# EAGLE design Phototransistor1 (EAGLE 8.5.0)
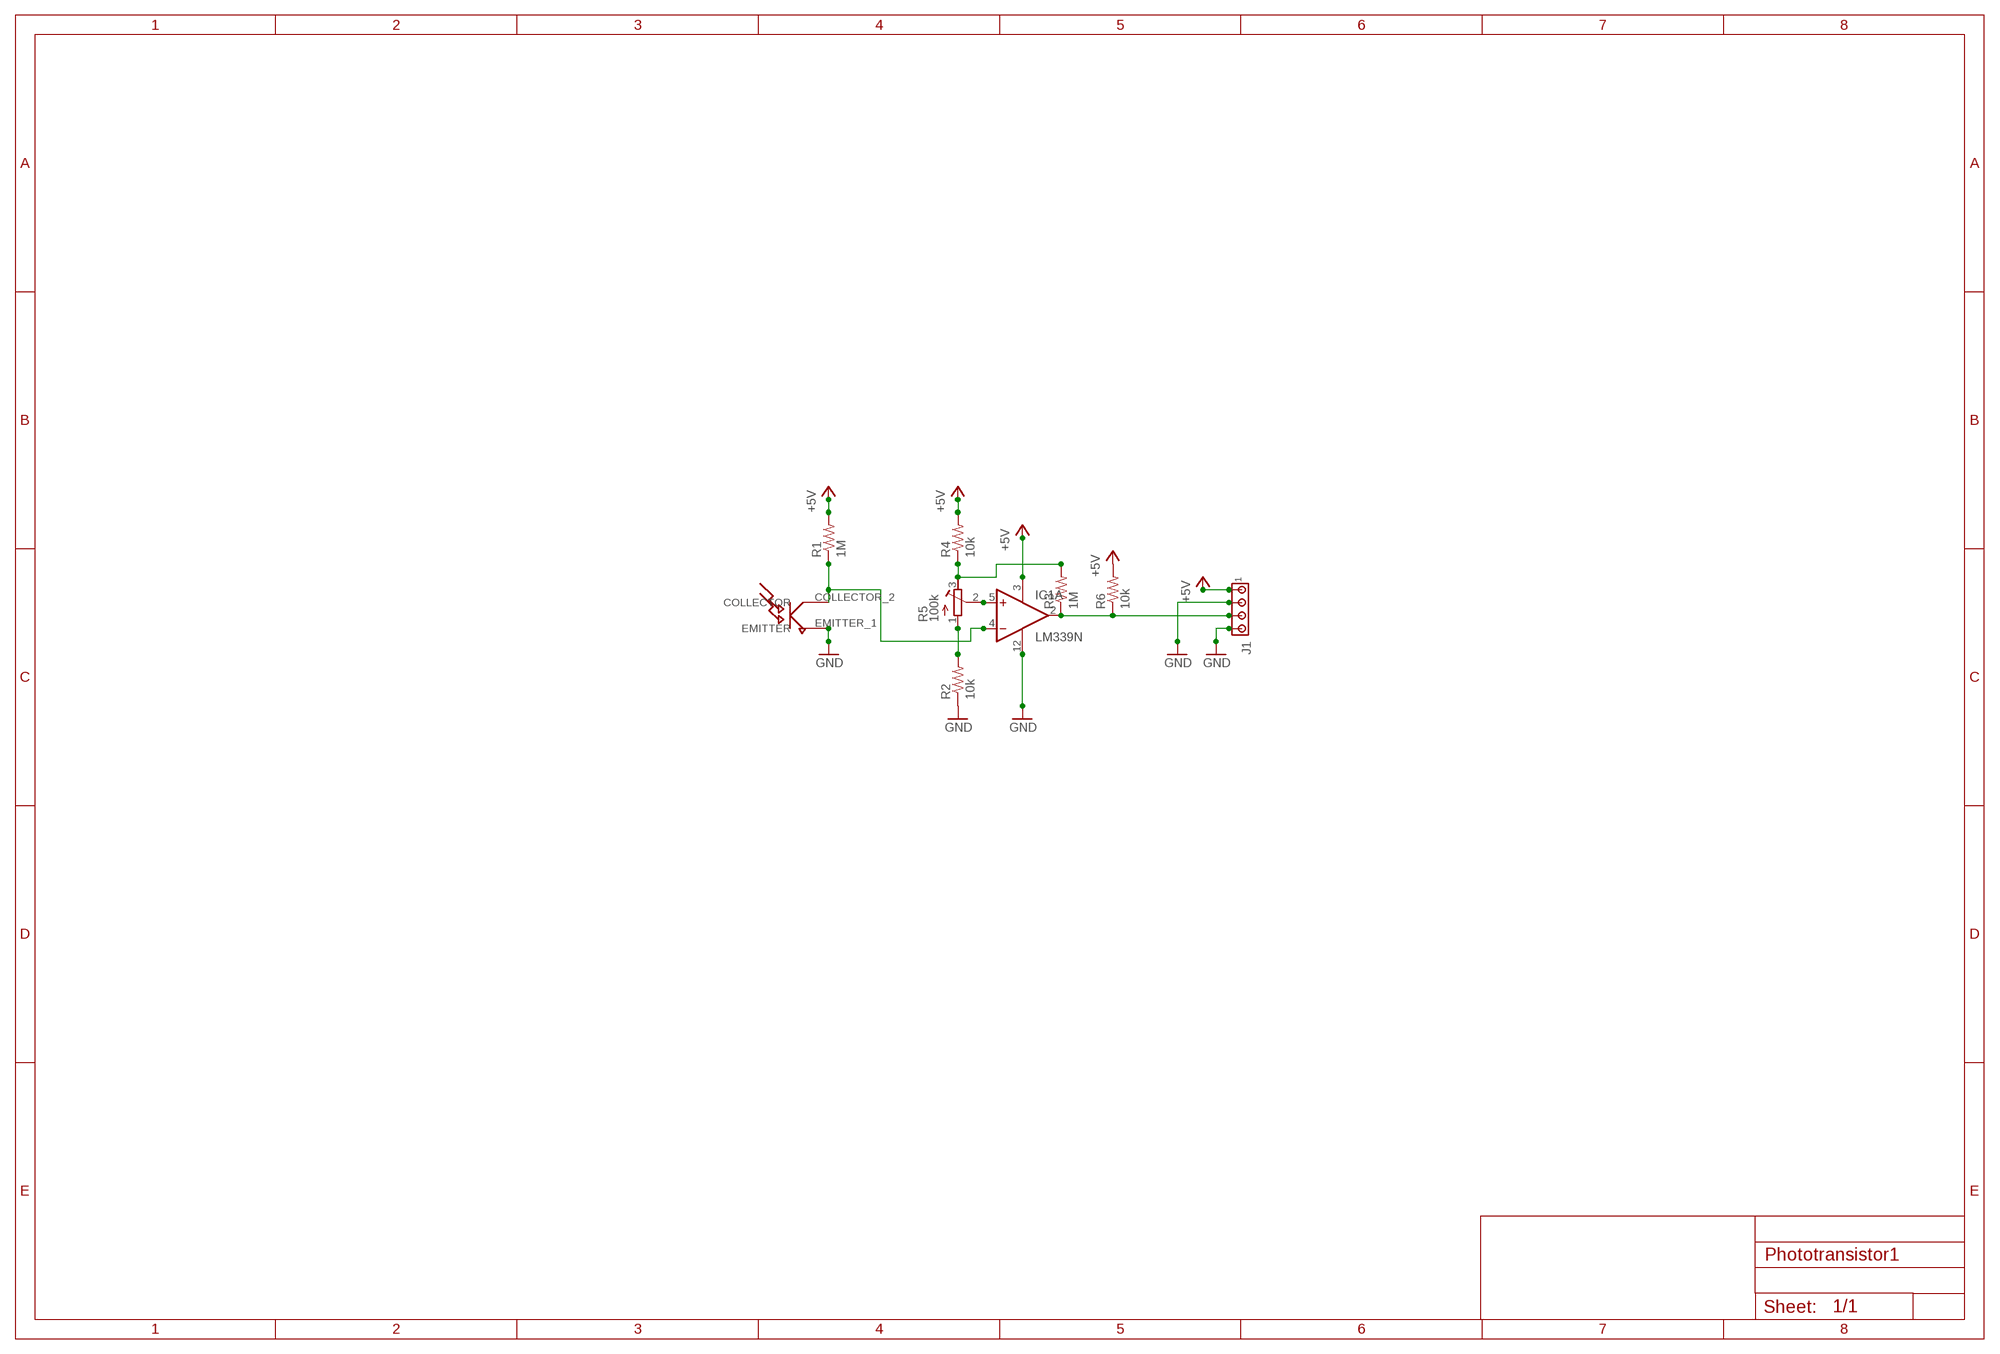
[diagram p0: schematic, sheet 1]

## Parts
IC1  LM339N  [DIL14]
J1  MTA04-100  [10X04MTA]
R1  1M  R-US_0204/7  [0204/7]
R2  10k  R-US_0204/7  [0204/7]
R3  1M  R-US_0204/7  [0204/7]
R4  10k  R-US_0204/7  [0204/7]
R5  100k  R-TRIMM3296W  [RTRIM3296W]
R6  10k  R-US_0204/7  [0204/7]
U$1  NTE3034  [NTE3034_]

## Nets
+5V: IC1.3(P:V+) J1.1 R1.2 R4.2 R6.2
GND: IC1.12(P:GND) J1.2 J1.4 R2.1 U$1.EMITTER_1(EMITTER)
N$1: IC1.4(A:-IN) R1.1 U$1.COLLECTOR_2(COLLECTOR)
N$2: IC1.5(A:+IN) R5.2(S)
N$3: R3.2 R4.1 R5.3(A)
N$4: R2.2 R5.1(E)
N$5: IC1.2(A:OUT) J1.3 R3.1 R6.1
Unconnected: IC1.1(B:OUT) IC1.6(B:-IN) IC1.7(B:+IN) IC1.8(C:-IN) IC1.9(C:+IN) IC1.10(D:-IN) IC1.11(D:+IN) IC1.13(D:OUT) IC1.14(C:OUT)

## Library data of the parts
IC1 = linear:LM339: Low Power Low Offset Voltage Quad Comparators with open collector; LM139/LM239/LM339/LM2901/LM3302
J1 = con-amp:MTA04-100: AMP connector
R1-R4 R6 = resistor:R-US_: RESISTOR, American symbol
R5 = resistor:R-TRIMM: Trimm resistor
U$1 = Anthony-Relay:NTE3034

## Board
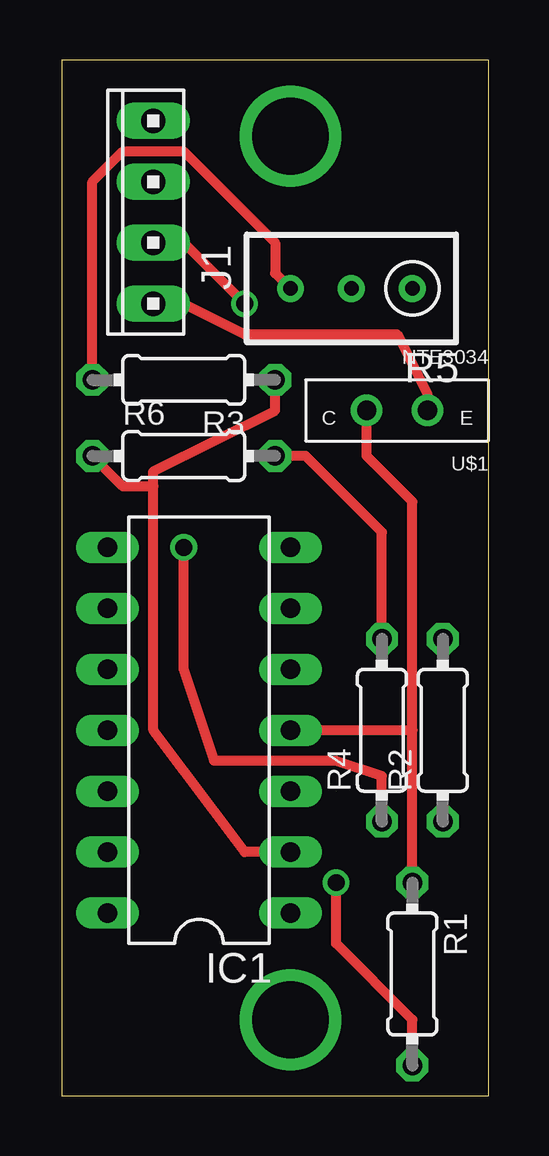
[diagram p1: board, top side]
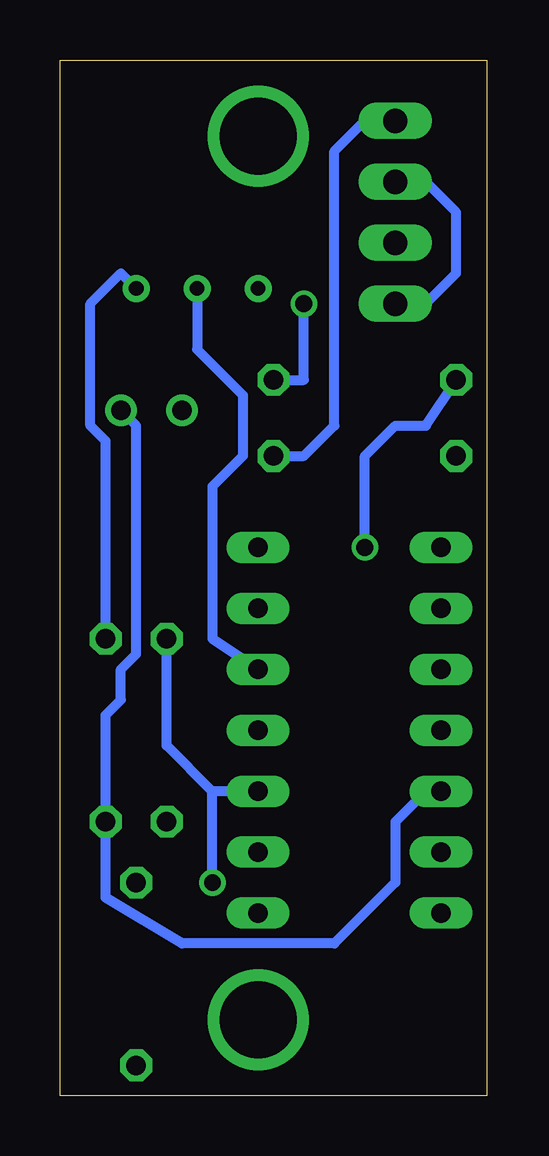
[diagram p2: board, bottom side, seen from below]

Size 17.78 x 43.18 mm. Coordinates in mm from the lower left corner, seen from the top.
Outline: 0,0 17.78,0 17.78,43.18 0,43.18 0,0
Copper layers (1*16): Top 0.035mm / dielectric 1.5mm / Bottom 0.035mm
Design rules "default": minimum track width 10mil, minimum drill 24mil, track to track 8mil, track to pad 8mil, pad to pad 8mil, via to via 8mil, smd to smd 8mil, copper to edge 40mil, drill to drill 8mil, minimum pad ring 10mil, minimum via ring 8mil, stop-mask expansion 4mil, vias tented up to drill 0mil, thermal gap 10mil

### Footprints (pad centres in the part's own frame; a part is rotated, then mirrored left to right if it is on the bottom)
DIL14 = drill 0.813 long: 1 -7.62,-3.81; 2 -5.08,-3.81; 3 -2.54,-3.81; 4 0,-3.81; 5 2.54,-3.81; 6 5.08,-3.81; 7 7.62,-3.81; 8 7.62,3.81; 9 5.08,3.81; 10 2.54,3.81; 11 0,3.81; 12 -2.54,3.81; 13 -5.08,3.81; 14 -7.62,3.81
10X04MTA = drill 1.016 long: 1 3.81,0; 2 1.27,0; 3 -1.27,0; 4 -3.81,0
0204/7 = drill 0.813 octagon: 1 -3.81,0; 2 3.81,0
RTRIM3296W = drill 0.61 round: 1 0,-2.54; 2 0,0; 3 0,2.54
NTE3034_ = drill 0.8 round: COLLECTOR_2 1.27,0; EMITTER_1 -1.27,0

### Placement (x,y rotation side)
IC1  5.71,15.24 90 top
J1  3.81,36.83 90 top
R1  14.61,5.08 270 top
R2  15.88,15.24 90 top
R3  5.08,29.84 180 top
R4  13.34,15.24 90 top
R5  12.06,33.66 90 top
R6  5.08,26.67 0 top
U$1  13.97,28.57 180 top

### Tracks (layer width: path | path; a pad name or v marks a point on that pad's centre or on a via)
+5V  (via drill 0.7)  (1 unrouted)
  Top 0.406: R4.2 13.34,23.5 10.16,26.67 R6.2 | R1.2 14.61,3.17 11.43,6.35 v11.43,8.89
  Bottom 0.406: J1.1 5.08,40.64 6.35,39.37 6.35,27.94 7.62,26.67 R6.2 | R4.2 13.34,14.61 11.43,12.7 | IC1.3 11.43,12.7 | v11.43,8.89 11.43,12.7
GND
  Top 0.406: J1.4 5.08,33.02 7.62,31.75 13.97,31.75 15.24,29.21 U$1.EMITTER_1
  Bottom 0.406: J1.2 2.54,38.1 1.27,36.83 1.27,34.29 2.54,33.02 J1.4 | IC1.12 2.54,12.7 3.81,11.43 3.81,8.89 6.35,6.35 12.7,6.35 15.88,8.26 R2.1 15.88,15.88 15.24,16.51 15.24,17.78 14.61,18.41 14.61,27.94 U$1.EMITTER_1
N$1
  Top 0.406: R1.1 14.61,15.24 | 14.61,15.24 14.61,24.77 12.7,26.67 U$1.COLLECTOR_2 | 14.61,15.24 IC1.4
N$2
  Bottom 0.406: R5.2 12.06,31.11 10.16,29.21 10.16,26.67 11.43,25.4 11.43,19.05 IC1.5
N$3  (via drill 0.7)
  Top 0.406: R3.2 1.27,38.1 2.54,39.37 5.08,39.37 8.89,35.56 8.89,34.29 R5.3 | R4.1 13.34,13.34 11.43,13.97 6.35,13.97 5.08,17.78 v5.08,22.86
  Bottom 0.406: 5.08,26.67 v5.08,22.86 5.08,26.67 | 5.08,26.67 3.81,27.94 2.54,27.94 R3.2
N$4
  Bottom 0.406: R2.2 15.88,27.3 16.51,27.94 16.51,33.02 15.24,34.29 R5.1
N$5  (via drill 0.7)
  Top 0.406: J1.3 5.08,35.56 v7.62,33.02 | IC1.2 7.62,10.16 3.81,15.24 3.81,25.4 | 3.81,25.4 3.81,26.04 8.89,28.57 R3.1 | R6.1 2.54,25.4 3.81,25.4
  Bottom 0.406: v7.62,33.02 7.62,29.84 R3.1
N$6  (via drill 3.2)
  other vias: 9.53,3.17
N$7  (via drill 3.2)
  other vias: 9.53,40.01